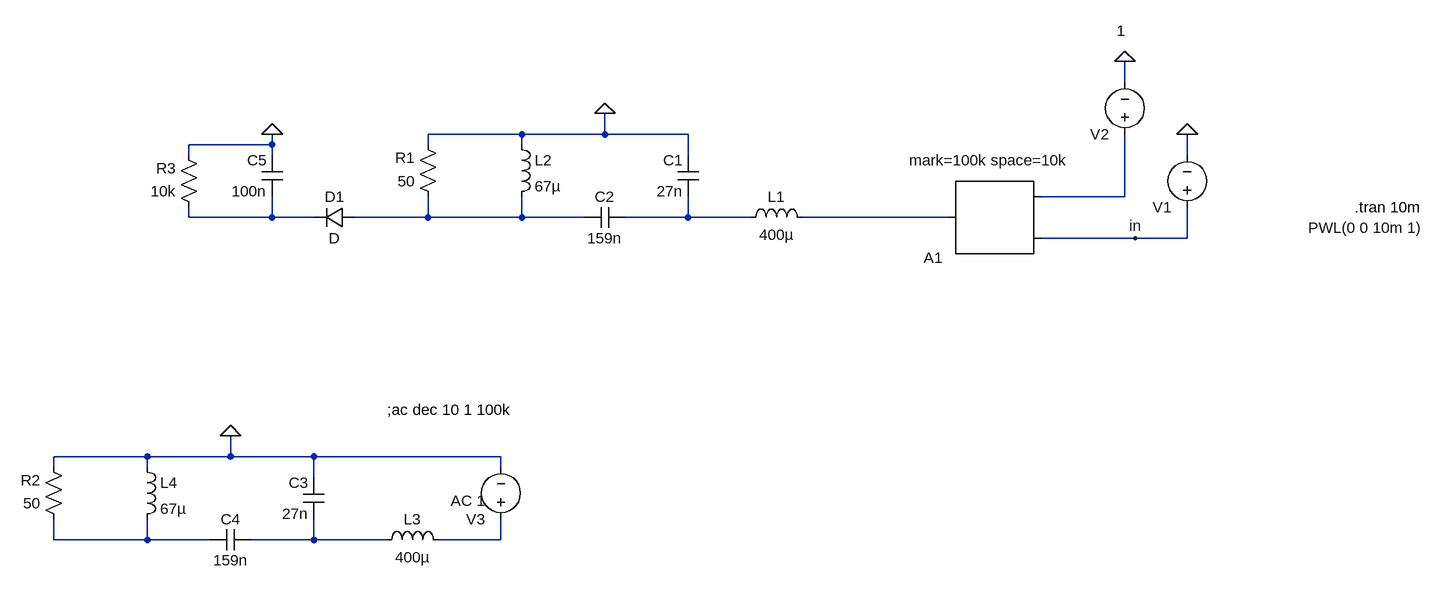
[diagram p0: schematic Sweep_Generator.asc]
Sweep_Generator.asc, the LTspice schematic file:
Version 4
SHEET 1 1672 680
WIRE 1168 -256 1168 -288
WIRE 240 -176 96 -176
WIRE 368 -176 368 -208
WIRE 368 -176 240 -176
WIRE 496 -176 368 -176
WIRE -144 -160 -144 -176
WIRE -144 -160 -272 -160
WIRE 96 -160 96 -176
WIRE 240 -160 240 -176
WIRE -272 -144 -272 -160
WIRE -144 -144 -144 -160
WIRE 496 -144 496 -176
WIRE 1264 -144 1264 -176
WIRE 1168 -80 1168 -176
WIRE 1168 -80 1040 -80
WIRE -272 -48 -272 -64
WIRE -144 -48 -144 -80
WIRE -144 -48 -272 -48
WIRE -80 -48 -144 -48
WIRE 96 -48 96 -80
WIRE 96 -48 -16 -48
WIRE 240 -48 240 -80
WIRE 240 -48 96 -48
WIRE 336 -48 240 -48
WIRE 496 -48 496 -80
WIRE 496 -48 400 -48
WIRE 592 -48 496 -48
WIRE 896 -48 672 -48
WIRE 1184 -16 1040 -16
WIRE 1264 -16 1264 -64
WIRE 1264 -16 1184 -16
WIRE -336 320 -480 320
WIRE -208 320 -208 288
WIRE -208 320 -336 320
WIRE -80 320 -208 320
WIRE 208 320 -80 320
WIRE -480 336 -480 320
WIRE -336 336 -336 320
WIRE 208 336 208 320
WIRE -80 352 -80 320
WIRE -480 448 -480 416
WIRE -336 448 -336 416
WIRE -336 448 -480 448
WIRE -240 448 -336 448
WIRE -80 448 -80 416
WIRE -80 448 -176 448
WIRE 32 448 -80 448
WIRE 208 448 208 416
WIRE 208 448 112 448
FLAG 1264 -176 0
FLAG 1168 -288 0
FLAG 1184 -16 in
FLAG -208 288 0
FLAG 368 -208 0
FLAG -144 -176 0
SYMBOL SpecialFunctions\\modulate 1040 -16 R180
WINDOW 3 -41 120 Left 2
SYMATTR Value mark=100k space=10k
SYMATTR InstName A1
SYMBOL voltage 1264 -48 R180
WINDOW 123 0 0 Left 2
WINDOW 39 0 0 Left 2
WINDOW 3 -362 -16 Left 2
SYMATTR Value PWL(0 0 10m 1)
SYMATTR InstName V1
SYMBOL voltage 1168 -160 R180
WINDOW 123 0 0 Left 2
WINDOW 39 0 0 Left 2
WINDOW 3 -1 175 Left 2
SYMATTR Value 1
SYMATTR InstName V2
SYMBOL ind 16 464 R270
WINDOW 0 32 56 VTop 2
WINDOW 3 5 56 VBottom 2
SYMATTR InstName L3
SYMATTR Value 400µ
SYMBOL ind -352 320 R0
SYMATTR InstName L4
SYMATTR Value 67µ
SYMBOL cap -64 416 R180
WINDOW 0 24 56 Left 2
WINDOW 3 24 8 Left 2
SYMATTR InstName C3
SYMATTR Value 27n
SYMBOL cap -240 464 R270
WINDOW 0 32 32 VTop 2
WINDOW 3 0 32 VBottom 2
SYMATTR InstName C4
SYMATTR Value 159n
SYMBOL res -464 432 R180
WINDOW 0 36 76 Left 2
WINDOW 3 36 40 Left 2
SYMATTR InstName R2
SYMATTR Value 50
SYMBOL voltage 208 432 R180
WINDOW 123 24 44 Left 2
WINDOW 39 0 0 Left 2
SYMATTR InstName V3
SYMATTR Value ""
SYMATTR Value2 AC 1
SYMBOL ind 576 -32 R270
WINDOW 0 32 56 VTop 2
WINDOW 3 5 56 VBottom 2
SYMATTR InstName L1
SYMATTR Value 400µ
SYMBOL ind 224 -176 R0
SYMATTR InstName L2
SYMATTR Value 67µ
SYMBOL cap 512 -80 R180
WINDOW 0 24 56 Left 2
WINDOW 3 24 8 Left 2
SYMATTR InstName C1
SYMATTR Value 27n
SYMBOL cap 336 -32 R270
WINDOW 0 32 32 VTop 2
WINDOW 3 0 32 VBottom 2
SYMATTR InstName C2
SYMATTR Value 159n
SYMBOL res 112 -64 R180
WINDOW 0 36 76 Left 2
WINDOW 3 36 40 Left 2
SYMATTR InstName R1
SYMATTR Value 50
SYMBOL diode -16 -64 R90
WINDOW 0 0 32 VBottom 2
WINDOW 3 32 32 VTop 2
SYMATTR InstName D1
SYMBOL cap -128 -80 R180
WINDOW 0 24 56 Left 2
WINDOW 3 24 8 Left 2
SYMATTR InstName C5
SYMATTR Value 100n
SYMBOL res -256 -48 R180
WINDOW 0 36 76 Left 2
WINDOW 3 36 40 Left 2
SYMATTR InstName R3
SYMATTR Value 10k
TEXT 1624 -64 Right 2 !.tran 10m
TEXT 224 248 Right 2 !;ac dec 10 1 100k

The netlist it stands for:
* Sweep_Generator.asc
A1 in N001 0 0 0 0 N005 0 MODULATOR mark=100k space=10k
V1 in 0 PWL(0 0 10m 1)
V2 N001 0 1
L3 N007 N008 400µ
L4 0 N006 67µ
C3 N007 0 27n
C4 N006 N007 159n
R2 N006 0 50
V3 N008 0 AC 1
L1 N004 N005 400µ
L2 0 N003 67µ
C1 N004 0 27n
C2 N003 N004 159n
R1 N003 0 50
D1 N003 N002 D
C5 N002 0 100n
R3 N002 0 10k
.model D D
.lib standard.dio
.tran 10m
;ac dec 10 1 100k
.backanno
.end